# EAGLE schematic Schematic (EAGLE 9.2.2)
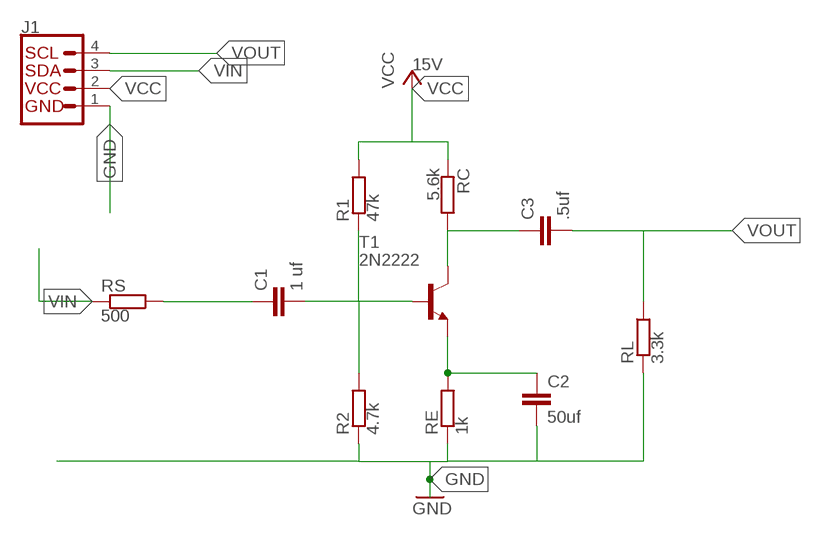
[diagram p0: schematic, sheet 1]

## Parts
C1  1 uf  C2,5-3  [C2.5-3]
C2  50uf  C2,5-3  [C2.5-3]
C3  .5uf  C2,5-3  [C2.5-3]
J1  QWIIC_CONNECTORJS-1MM  [1X04_1MM_RA]
R1  47k  BVS  [BVS]
R2  4.7k  BVS  [BVS]
RC  5.6k  BVS  [BVS]
RE  1k  BVS  [BVS]
RL  3.3k  BVS  [BVS]
RS  500  BVS  [BVS]
T1  2N2222  [TO18]

## Nets
GND: C2.2 J1.1 R2.2 RE.2 RL.2
N$1: C1.1 RS.1
N$2: C1.2 R1.2 R2.1 T1.2(B)
N$3: C3.1 RC.1 T1.3(C)
N$4: C2.1 RE.1 T1.1(E)
VCC: R1.1 RC.2
VIN: J1.3 RS.2
VOUT: C3.2 J1.4 RL.1

## Power pins joined to a net without a drawn wire
2: J1.2

## Library data of the parts
C1-C3 = capacitor-wima:C: CAPACITOR naming: grid - package width
J1 = SparkFun-Connectors:QWIIC_CONNECTOR: SparkFun I2C Standard Qwiic Connector An SMD 1mm pitch JST connector makes it easy and quick (get it? Qwiic?) to connect I2C devices to each other. The Qwiic system <http://www.sparkfun.com/qwiic> enables fast and solderless connection between popular platforms and various sensors and actuators. We carry 200mm <https://www.sparkfun.com/products/14204>, 100mm <https://www.sparkfun.com/products/14205>, 50mm <https://www.sparkfun.com/products/14206>, and breadboard friendly <https://www.sparkfun.com/products/14207> Qwiic cables. We also offer 10 pcs strips <https://www.sparkfun.com/products/14323> the SMD connectors.; PROD_ID: CONN-13694
R1 R2 RC RE RL RS = resistor-shunt:BVS: SMD SHUNT RESISTOR; OC_FARNELL: unknown; OC_NEWARK: unknown
T1 = transistor-neu-to92:2N2222: NPN TRANSISTOR